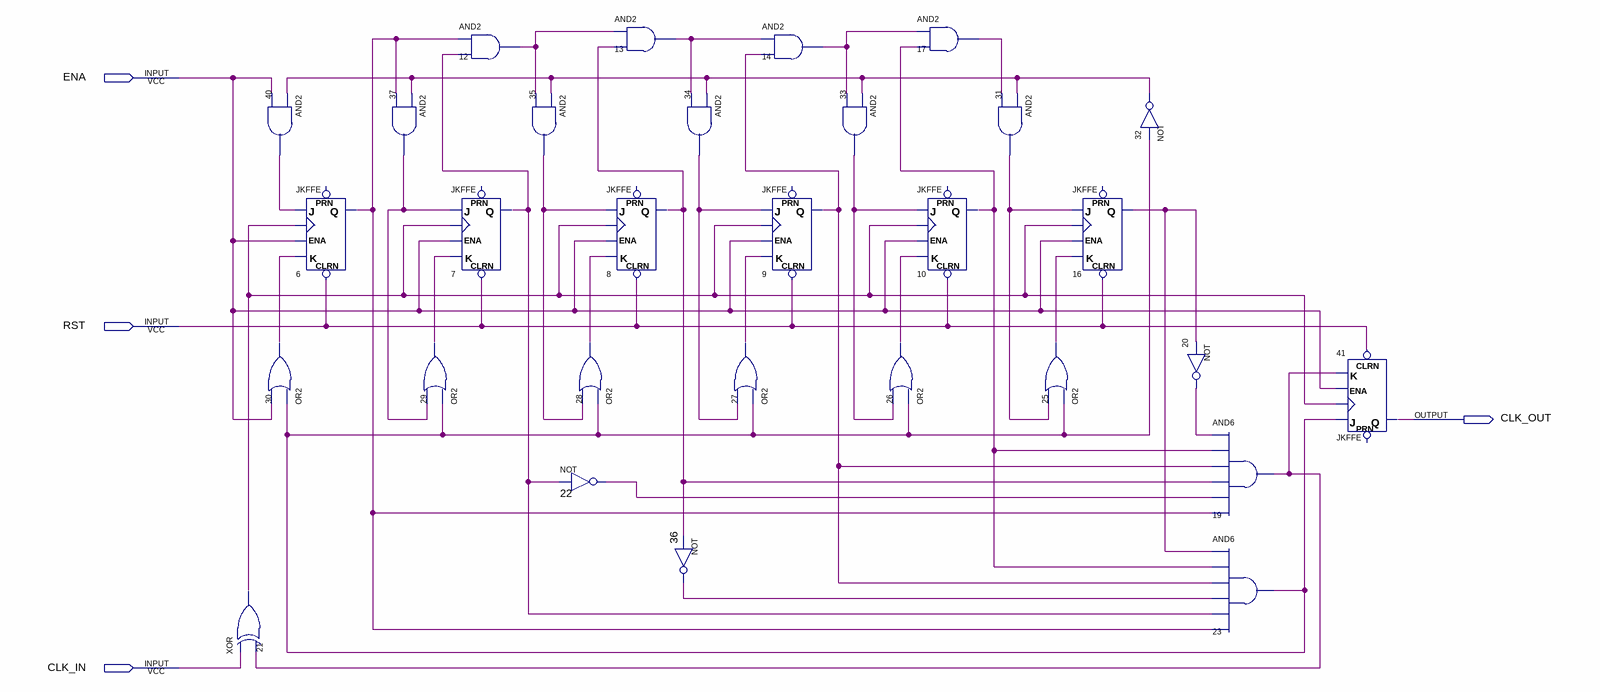
[diagram p0: schematic sheet]
// Quartus schematic div59.bdf as structural Verilog: 30 symbols, 4 pins
module div59 (
  input  ENA,
  input  RST,
  input  CLK_IN,
  output CLK_OUT
);

  wire n6_q, n7_q, n8_q, n9_q, n10_q, n12_out, n13_out, n14_out, n16_q, n17_out, n19_out, n20_out, n21_out,
       n22_out, n23_out, n25_out, n26_out, n27_out, n28_out, n29_out, n30_out, n31_out, n32_out, n33_out,
       n34_out, n35_out, n36_out, n37_out, n40_out;

  xor u_21 (n21_out, CLK_IN, n19_out);
  and u_40 (n40_out, n32_out, ENA);
  JKFFE u_6 (.J(n40_out), .CLK(n21_out), .CLRN(RST), .K(n30_out), .ENA(ENA), .Q(n6_q));  // open: PRN
  or u_30 (n30_out, n23_out, ENA);
  and u_37 (n37_out, n32_out, n6_q);
  or u_29 (n29_out, n23_out, n37_out);
  and u_12 (n12_out, n6_q, n7_q);
  JKFFE u_7 (.J(n37_out), .CLK(n21_out), .CLRN(RST), .K(n29_out), .ENA(ENA), .Q(n7_q));  // open: PRN
  and u_35 (n35_out, n32_out, n12_out);
  and u_13 (n13_out, n12_out, n8_q);
  JKFFE u_8 (.J(n35_out), .CLK(n21_out), .CLRN(RST), .K(n28_out), .ENA(ENA), .Q(n8_q));  // open: PRN
  or u_28 (n28_out, n23_out, n35_out);
  not u_22 (n22_out, n7_q);
  not u_36 (n36_out, n8_q);
  and u_34 (n34_out, n32_out, n13_out);
  or u_27 (n27_out, n23_out, n34_out);
  and u_14 (n14_out, n13_out, n9_q);
  JKFFE u_9 (.J(n34_out), .CLK(n21_out), .CLRN(RST), .K(n27_out), .ENA(ENA), .Q(n9_q));  // open: PRN
  and u_33 (n33_out, n32_out, n14_out);
  and u_17 (n17_out, n14_out, n10_q);
  JKFFE u_10 (.J(n33_out), .CLK(n21_out), .CLRN(RST), .K(n26_out), .ENA(ENA), .Q(n10_q));  // open: PRN
  or u_26 (n26_out, n23_out, n33_out);
  and u_31 (n31_out, n32_out, n17_out);
  or u_25 (n25_out, n23_out, n31_out);
  JKFFE u_16 (.J(n31_out), .CLK(n21_out), .CLRN(RST), .K(n25_out), .ENA(ENA), .Q(n16_q));  // open: PRN
  not u_32 (n32_out, n23_out);
  not u_20 (n20_out, n16_q);
  and u_19 (n19_out, n20_out, n10_q, n9_q, n8_q, n22_out, n6_q);
  and u_23 (n23_out, n16_q, n10_q, n9_q, n36_out, n7_q, n6_q);
  JKFFE u_41 (.J(n23_out), .CLK(n21_out), .CLRN(RST), .K(n19_out), .ENA(ENA), .Q(CLK_OUT));  // open: PRN
endmodule
